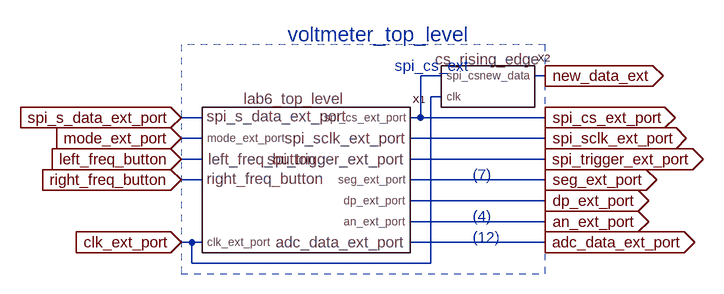
[diagram p0: schematic Voltmeter_shell.asc]
Voltmeter_shell.asc, the LTspice schematic file:
Version 4
SHEET 1 880 724
WIRE 416 336 384 336
WIRE 576 336 560 336
WIRE 416 368 400 368
WIRE 48 400 16 400
WIRE 384 400 384 336
WIRE 384 400 368 400
WIRE 576 400 384 400
WIRE 48 432 16 432
WIRE 576 432 368 432
WIRE 48 464 16 464
WIRE 576 464 368 464
WIRE 48 496 16 496
WIRE 576 496 368 496
WIRE 576 528 368 528
WIRE 576 560 368 560
WIRE 32 592 16 592
WIRE 48 592 32 592
WIRE 576 592 368 592
WIRE 32 624 32 592
WIRE 400 624 400 368
WIRE 400 624 32 624
FLAG 16 592 clk_ext_port
IOPIN 16 592 In
FLAG 16 400 spi_s_data_ext_port
IOPIN 16 400 In
FLAG 16 432 mode_ext_port
IOPIN 16 432 In
FLAG 576 336 new_data_ext
IOPIN 576 336 Out
FLAG 576 400 spi_cs_ext_port
IOPIN 576 400 Out
FLAG 576 432 spi_sclk_ext_port
IOPIN 576 432 Out
FLAG 576 464 spi_trigger_ext_port
IOPIN 576 464 Out
FLAG 576 496 seg_ext_port
IOPIN 576 496 Out
FLAG 576 528 dp_ext_port
IOPIN 576 528 Out
FLAG 576 560 an_ext_port
IOPIN 576 560 Out
FLAG 16 464 left_freq_button
IOPIN 16 464 In
FLAG 16 496 right_freq_button
IOPIN 16 496 In
FLAG 576 592 adc_data_ext_port
IOPIN 576 592 Out
SYMBOL lab6_top_level 192 464 R0
SYMATTR InstName X1
SYMBOL cs_rising_edge 480 352 R0
SYMATTR InstName X2
TEXT 320 272 Center 3 ;voltmeter_top_level
TEXT 464 488 Left 2 ;(7)
TEXT 464 552 Left 2 ;(4)
TEXT 464 584 Left 2 ;(12)
TEXT 344 320 Left 2 ;spi_cs_ext
RECTANGLE Normal 16 640 576 288 2

The netlist it stands for:
* Voltmeter_shell.asc
XX1 clk_ext_port spi_cs_ext_port spi_sclk_ext_port spi_s_data_ext_port spi_trigger_ext_port mode_ext_port left_freq_button right_freq_button seg_ext_port dp_ext_port an_ext_port adc_data_ext_port lab6_top_level  ; pins clk_ext_port spi_cs_ext_port spi_sclk_ext spi_s_data spi_trigger mode_ext_port left_freq_btn right_freq_btn seg_ext_port dp_ext_port an_ext_port adc_data
XX2 spi_cs_ext_port clk_ext_port new_data_ext cs_rising_edge  ; pins spi_cs clk new_data
* voltmeter_top_level
* (7)
* (4)
* (12)
* spi_cs_ext
.backanno
.end